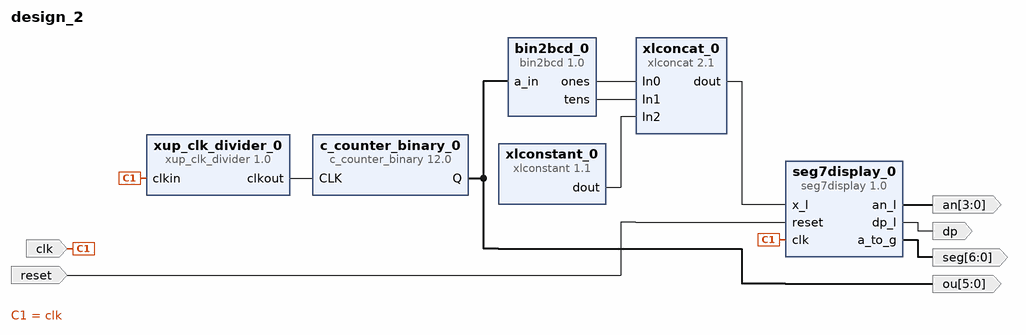
[diagram p0: block diagram of the top level]
# Vivado block design design_2, xc7a35tcpg236-1, Vivado 2023.1
create_bd_design design_2

create_bd_port -dir I clk
create_bd_port -dir I reset
create_bd_port -dir O -from 3 -to 0 an
create_bd_port -dir O -from 6 -to 0 seg
create_bd_port -dir O dp
create_bd_port -dir O -from 5 -to 0 ou

create_bd_cell -type ip -vlnv xilinx.com:ip:c_counter_binary:12.0 c_counter_binary_0
set_property -dict {CONFIG.Output_Width 6} [get_bd_cells c_counter_binary_0]
create_bd_cell -type ip -vlnv xilinx.com:XUP:xup_clk_divider:1.0 xup_clk_divider_0
set_property -dict {CONFIG.SIZE 2} [get_bd_cells xup_clk_divider_0]
create_bd_cell -type ip -vlnv xilinx.com:XUP:seg7display:1.0 seg7display_0
create_bd_cell -type ip -vlnv xilinx.com:XUP:bin2bcd:1.0 bin2bcd_0
set_property -dict {CONFIG.SIZE 6} [get_bd_cells bin2bcd_0]
create_bd_cell -type ip -vlnv xilinx.com:ip:xlconcat:2.1 xlconcat_0
set_property -dict {CONFIG.IN0_WIDTH 4 CONFIG.IN1_WIDTH 4 CONFIG.IN2_WIDTH 8 CONFIG.NUM_PORTS 3} [get_bd_cells xlconcat_0]
create_bd_cell -type ip -vlnv xilinx.com:ip:xlconstant:1.1 xlconstant_0
set_property -dict {CONFIG.CONST_VAL 0 CONFIG.CONST_WIDTH 8} [get_bd_cells xlconstant_0]

# ---- connections ----

connect_bd_net [get_bd_pins bin2bcd_0/ones] [get_bd_pins xlconcat_0/In0]
connect_bd_net [get_bd_pins bin2bcd_0/tens] [get_bd_pins xlconcat_0/In1]
connect_bd_net [get_bd_pins c_counter_binary_0/Q] [get_bd_ports ou] [get_bd_pins bin2bcd_0/a_in]
connect_bd_net [get_bd_ports clk] [get_bd_pins xup_clk_divider_0/clkin] [get_bd_pins seg7display_0/clk]
connect_bd_net [get_bd_ports reset] [get_bd_pins seg7display_0/reset]
connect_bd_net [get_bd_pins seg7display_0/a_to_g] [get_bd_ports seg]
connect_bd_net [get_bd_pins seg7display_0/an_l] [get_bd_ports an]
connect_bd_net [get_bd_pins seg7display_0/dp_l] [get_bd_ports dp]
connect_bd_net [get_bd_pins xlconcat_0/dout] [get_bd_pins seg7display_0/x_l]
connect_bd_net [get_bd_pins xlconstant_0/dout] [get_bd_pins xlconcat_0/In2]
connect_bd_net [get_bd_pins xup_clk_divider_0/clkout] [get_bd_pins c_counter_binary_0/CLK]

validate_bd_design
save_bd_design
